# Altium schematic sheet Safety_LightsSch.SchDoc
size A
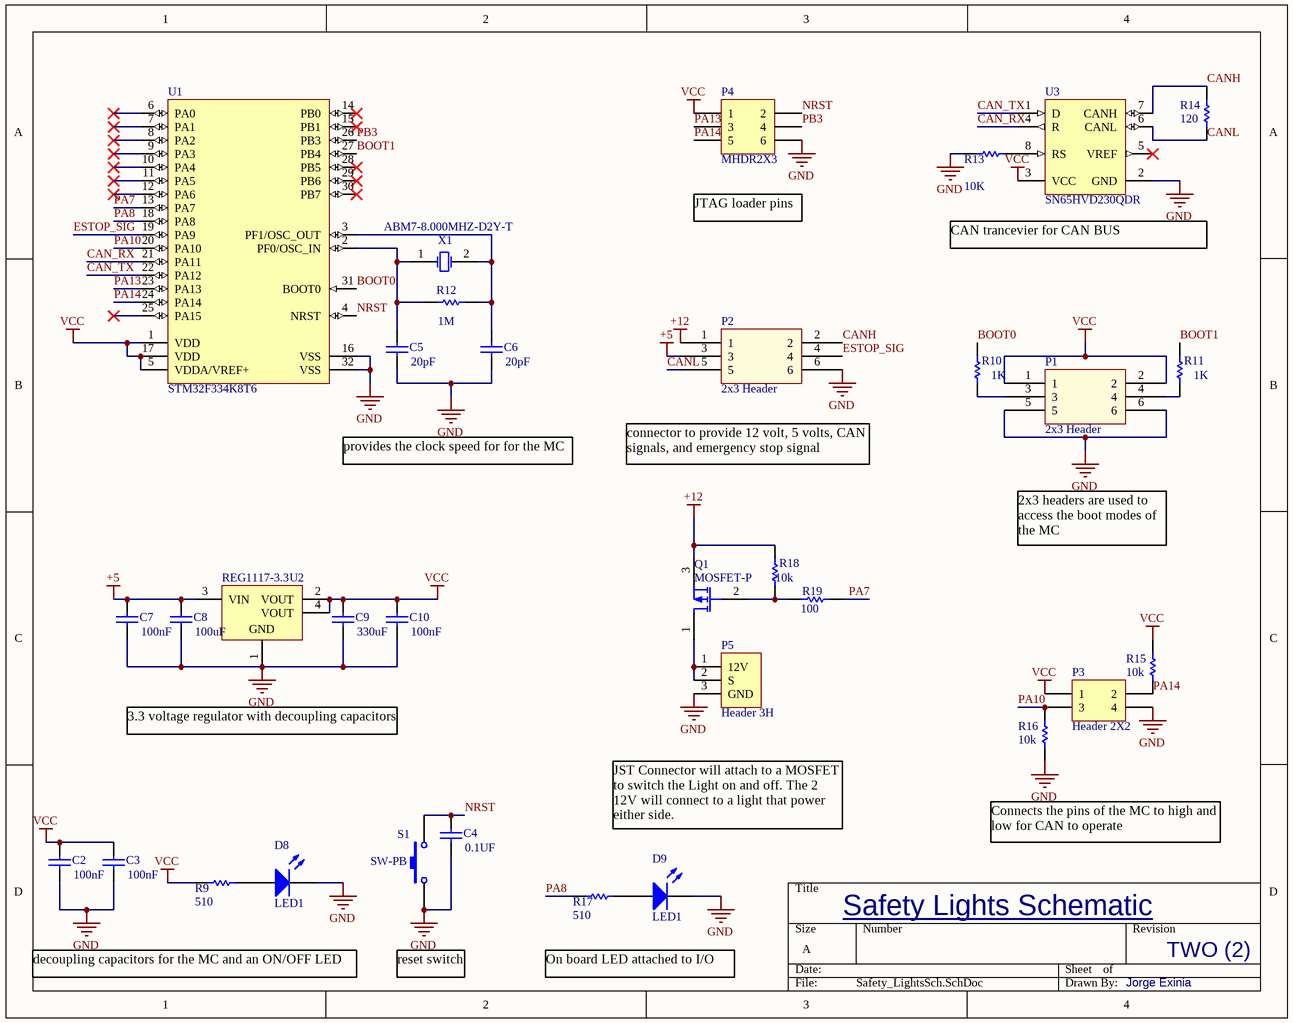
[diagram p0: Safety_LightsSch.SchDoc]

## Parts
C2  value 100nF  [6-0805_L]  (hidden comment: Cap)
C3  value 100nF  [6-0805_L]  (hidden comment: Cap)
C4  value 0.1UF  [6-0805_L]  (hidden comment: Cap)
C5  value 20pF  [6-0805_L]  (hidden comment: Cap)
C6  value 20pF  [6-0805_L]  (hidden comment: Cap)
C7  value 100nF  [6-0805_L]  (hidden comment: Cap)
C8  value 100uF  [6-0805_L]  (hidden comment: Cap)
C9  value 330uF  [6-0805_L]  (hidden comment: Cap)
C10  value 100nF  [6-0805_L]  (hidden comment: Cap)
D8  LED1  [6-0805_L]
D9  LED1  [6-0805_L]
P1  2x3 Header  [HDR2X3]
P2  2x3 Header  [Molex Connector]
P3  Header 2X2  [HDR2X2]
P4  MHDR2X3  [HDR2X3]
P5  Header 3H  [HDR1X3]
Q1  MOSFET-P  [E3]
R9  value 510  [1608[0603]]  (hidden comment: Res1)
R10  value 1K  [1608[0603]]  (hidden comment: Res1)
R11  value 1K  [1608[0603]]  (hidden comment: Res1)
R12  value 1M  [1608[0603]]  (hidden comment: Res1)
R13  value 10K  [1608[0603]]  (hidden comment: Res1)
R14  value 120  [1608[0603]]  (hidden comment: Res1)
R15  value 10k  [1608[0603]]  (hidden comment: Res1)
R16  value 10k  [1608[0603]]  (hidden comment: Res1)
R17  value 510  [1608[0603]]  (hidden comment: Res1)
R18  value 10k  [1608[0603]]  (hidden comment: Res1)
R19  value 100  [1608[0603]]  (hidden comment: Res1)
S1  SW-PB  [Push Switch 3x6x2.5]
U1  STM32F334K8T6  [STM-LQFP32_M]
U2  REG1117-3.3  [DCY0004A_M]
U3  SN65HVD230QDR  [D0008A_L]
X1  ABM7-8.000MHZ-D2Y-T  [ABRA-ABM7-2_V]

## Nets
+5: C7.2 C8.2 P2.3 U2.3(VIN)
+12: P2.1 Q1.3(S) R18.2
GND: C2.1 C3.1 C4.1 C5.2 C6.2 C7.1 C8.1 C9.1 C10.1 D8.2(K) D9.2(K) P1.5 P1.6 P2.6 P3.4 P4.6 P5.3(GND) R13.1 R16.1 S1.1 U1.16(VSS) U1.32(VSS) U2.1(GND) U3.2(GND)
VCC: C2.2 C3.2 C9.2 C10.2 P1.1 P1.2 P3.1 P4.1 R9.1 R15.2 U1.1(VDD) U1.5(VDDA/VREF+) U1.17(VDD) U2.2(VOUT) U2.4(VOUT) U3.3(VCC)
BOOT0: R10.2 U1.31(BOOT0)
BOOT1: R11.2 U1.27(PB4)
CAN_RX: U1.21(PA11) U3.4(R)
CAN_TX: U1.22(PA12) U3.1(D)
CANH: P2.2 R14.2 U3.7(CANH)
CANL: P2.5 R14.1 U3.6(CANL)
ESTOP_SIG: P2.4 U1.19(PA9)
NRST: C4.2 P4.2 S1.2 U1.4(NRST)
PA7: R19.2 U1.13(PA7)
PA8: R17.1 U1.18(PA8)
PA10: P3.3 R16.2 U1.20(PA10)
PA13: P4.3 U1.23(PA13)
PA14: P3.2 P4.5 R15.1 U1.24(PA14)
PB3: P4.4 U1.26(PB3)
NetC5_1: C5.1 R12.1 U1.2(PF0/OSC_IN) X1.1(X1)
NetC6_1: C6.1 R12.2 U1.3(PF1/OSC_OUT) X1.2(X2)
NetD8_1: D8.1(A) R9.2
NetD9_1: D9.1(A) R17.2
NetP1_3: P1.3 R10.1
NetP1_4: P1.4 R11.1
NetP5_1: P5.1(12V) P5.2(S) Q1.1(D)
NetQ1_2: Q1.2(G) R18.1 R19.1
NetR13_2: R13.2 U3.8(RS)

Not connected (* = marked no-connect by the designer): U1 6(PA0)* 7(PA1)* 8(PA2)* 9(PA3)* 10(PA4)* 11(PA5)* 12(PA6)* 14(PB0)* 15(PB1)* 25(PA15)* 28(PB5)* 29(PB6)* 30(PB7)*; U3 5(VREF)*

## Notes on the sheet
- JTAG loader pins
- (near U3) CAN trancevier for CAN BUS communication
- provides the clock speed for for the MC
- connector to provide 12 volt, 5 volts, CAN signals, and emergency stop signal
- 2x3 headers are used to access the boot modes of the MC
- 3.3 voltage regulator with decoupling capacitors
- JST Connector will attach to a MOSFET to switch the Light on and off. The 2 12V will connect to a light that power either side.
- Connects the pins of the MC to high and low for CAN to operate
- decoupling capacitors for the MC and an ON/OFF LED
- reset switch
- On board LED attached to I/O pin
- Safety Lights Schematic <https://github.com/j-exinia/IGVC_Safety_Lights>
- TWO (2)
- Jorge Exinia

## Library data of the parts
C2-C10 = Cap: Capacitor; Published: 8-Jun-2000; LatestRevisionDate: 17-Jul-2002; LatestRevisionNote: Re-released for DXP Platform.; PackageReference: RAD-0.3; Publisher: Altium Limited; PackageDescription: Radial Cap, Thru-Hole; 2 Leads; 0.3 in Pin Spacing
D8 D9 = LED1: Typical RED GaAs LED; Published: 8-Jun-2000; LatestRevisionDate: 08-Jul-2005; LatestRevisionNote: Mech Layer 1 removed.; PackageReference: LED-1; Publisher: Altium Limited; PackageDescription: LED; 2 Leads
P3 = Header 2X2: Header, 2-Pin, Dual row; LatestRevisionDate: 17-Jul-2002; LatestRevisionNote: Re-released for DXP Platform.; Publisher: Altium Limited
P4 = MHDR2X3: Header, 3-Pin, Dual row; LatestRevisionDate: 17-Jul-2002; LatestRevisionNote: Re-released for DXP Platform.; Publisher: Altium Limited
P5 = Header 3H: Header, 3-Pin, Right Angle; LatestRevisionDate: 17-Jul-2002; LatestRevisionNote: Re-released for DXP Platform.; Publisher: Altium Limited
Q1 = MOSFET-P: P-Channel MOSFET; Published: 8-Jun-2000; LatestRevisionDate: 17-Jul-2002; LatestRevisionNote: Re-released for DXP Platform.; PackageVersion: 1995/1996; PackageReference: E3; Publisher: Altium Limited; PackageDescription: TO, Flat Index; 3 In-Line, Axial Leads; Body Dia. 4.6mm; Lead Dia. 0.5 mm (max)
R9-R19 = Res1: Resistor; Published: 8-Jun-2000; LatestRevisionDate: 17-Jul-2002; LatestRevisionNote: Re-released for DXP Platform.; PackageReference: AXIAL-0.3; Publisher: Altium Limited; PackageDescription: Axial Device, Thru-Hole; 2 Leads; 0.3 in Pin Spacing
S1 = SW-PB: Switch; Published: 24-Mar-1999; LatestRevisionDate: 17-Jul-2002; LatestRevisionNote: Re-released for DXP Platform.; PackageReference: SPST-2; Publisher: Altium Limited; PackageDescription: Switch; 2 Leads
U1 = CMP-0537-00074-1: ARM Cortex-M4 32-bit MCU, 64 KB Flash, 16 KB Internal RAM, 25 I/Os, 32-Pin LQFP, -40 to 85 degC, Tray; Operating Frequency(F) (Processor speed) (MHz): 72; Supply Voltage(Vcc) min (V): 2; D/A Converter: 3; FLASH Size (Prog) (kB): 64; I/Os (High Current): 25; Internal RAM Size (kB): 16; ComponentLink1URL: http://www.st.com/; Package Reference: LQFP32; ComponentLink1Description: Manufacturer URL; Packing: Tray; ComponentLink2Description: Datasheet; Core: ARM Cortex-M4; Package Description: 32-Pin Low Profile Quad Flat Package, 7 x 7 mm Body, 0.8 mm Pitch; DatasheetVersion: Rev. 4; ComponentLink2URL: http://www.st.com/st-web-ui/static/active/en/resource/technical/document/datasheet/DM00097745.pdf; Mounting Technology: Surface Mount
U2 = CMP-0395-00549-2: Single Output LDO, 800 mA, Fixed 3.3 V Output, 3.8 to 15 V Input, with Internal Current Limiting, 4-pin SOT-223 (DCY), -40 to 125 degC, Green (RoHS & no Sb/Br); Manufacturer: Texas Instruments; Vout Adj(Max)(V): 3.3; Vin(Max)(V): 15; Iq(Typ)(mA): 4; Iout(Max)(A): 0.8; Vdo(Typ)(mV): 1100; Vin(Min)(V): 3.8; SubFamily: Single Channel LDO; Rating: Catalog; Fixed Output Options(V): 5; ComponentLink1Description: Manufacturer URL; Eco-Plan: Green (RoHS & no Sb/Br); PackageReference: DCY0004A; Mounting Technology: Surface Mount; ComponentLink3Description: Package Specification; Vout Adj(Min)(V): 3.3; ComponentLink2URL: http://www.ti.com/general/docs/lit/getliterature.tsp?genericPartNumber=REG1117-33&fileType=pdf; PackageVersion: 4202506/B; ComponentLink3URL: http://www.ti.com/litv/pdf/mpds094a; Code_JEDEC: TO-261; ComponentLink1URL: http://www.ti.com/; ComponentLink2Description: Datasheet; PartNumber: REG1117-3.3; DatasheetVersion: SBVS001D; PackageDescription: 4-Pin Plastic Small Outline, Body 3.5 x 6.5 mm, Pitch 2.3 mm
U3 = CMP-0315-00033-2: Automotive Catalog 3.3 V CAN Transceiver, 17 mA, 3.3 V, -40 to 125 degC, 8-pin SOIC (D), Green (RoHS & no Sb/Br); Manufacturer: Texas Instruments; Transient Pulse Protection(V): -25 to 25; Receivers Per Package: 1; ICC(Max)(mA): 17; Supply Voltage(s)(V): 3.3; PackageDescription: 8-Pin Plastic Small Outline Integrated Circuit, 4.9 x 3.9 mm, Pitch 1.27 mm Pitch; Isolated: No; PackageReference: D0008A; SubFamily: CAN; PartNumber: SN65HVD230QDR; Footprint: PCA82C250; DatasheetVersion: SLOS346K; Drivers Per Package: 1; ComponentLink1URL: http://www.ti.com/lit/ds/symlink/sn65hvd230.pdf; PackageVersion: revM, Jun-2011; Code_JEDEC: MS-012AA; Rating: Catalog; Eco-Plan: Green (RoHS & no Sb/Br); ComponentLink1Description: Datasheet; Mounting Technology: Surface Mount
X1 = CMP-2000-05034-1: Microprocessor Crystal, 8 MHz, 18 PF, -40 to 85 degC, 2-Pin SMD, RoHS, Tape and Reel; Manufacturer: Abracon; Online Catalog: ABM7Series; Load Capacitance: 18pF; Frequency Stability: ±30ppm; ESR (Equivalent Series Resistance): 100Ohm; Frequency: 8MHz; Operating Mode: Fundamental; 3D Model: ABM7.pdf / ABM7.stp; Catalog Drawings: ABM7SeriesTop / ABM7SeriesSide / ABM7SeriesBottom; Other Names: 535-9831-2 / ABM7-8.000MHZ-D-2-Y-T / ABM78000MHZD2YT; Frequency Tolerance: ±20ppm; Featured Product: ABM7andABM11Crystals; Category: CrystalsandOscillators; Operating Temperature: -40degC~85degC; Datasheet URL: https://datasheet.ciiva.com/1357/1718755-1357277.pdf; Packaging: Tape&Reel(TR); Package Reference: ABM7; Type: MHzCrystal; Datasheet Version: Dec-17; Package Description: 2-Pin Surface Mount Device, Body 6 x 3.5 mm; RoHS Information: RoHS2/REACHCompliance; Height: 0.055"(1.40mm); Family: Crystals; Standard Package: 1,000; Size / Dimension: 0.236"Lx0.138"W(6.00mmx3.50mm); Manufacturer URL: http://www.abracon.com/; Mounting Type: SurfaceMount; Series: ABM7; Package / Case: 2-SMD